# Altium schematic sheet 4_MCU.SchDoc
size A; SheetNumber: 4; SheetTotal: 5
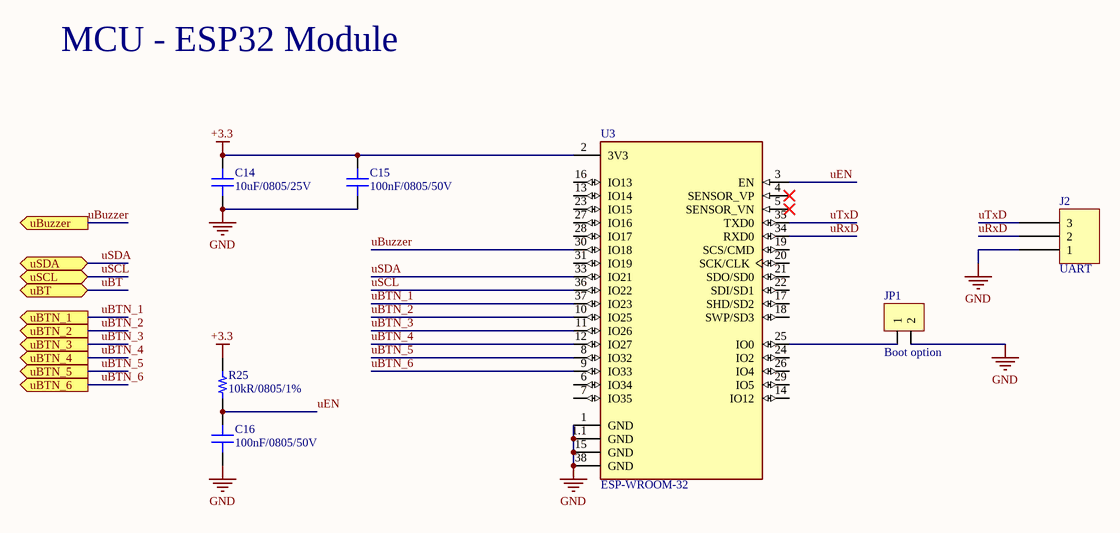
[diagram p0: 4_MCU.SchDoc]

## Parts
C14  10uF/0805/25V  [CAP FILM 0805]
C15  100nF/0805/50V  [CAP FILM 0805]
C16  100nF/0805/50V  [CAP FILM 0805]
J2  UART  [JST B3B-PH-K]
JP1  Boot option  [JP2-CLOSED]
R25  10kR/0805/1%  [RES 0805_2012]
U3  ESP-WROOM-32  [MODULE_ESP-WROOM-32]

## Ports
uBT (bidir), uBTN_1 (out), uBTN_2 (out), uBTN_3 (out), uBTN_4 (out), uBTN_5 (out), uBTN_6 (out), uBuzzer (out), uSCL (bidir), uSDA (bidir)

## Nets
+3.3: C14.2 C15.2 R25.2 U3.2(3V3)
GND: C14.1 C15.1 C16.1 J2.1 JP1.2 U3.1(GND) U3.1.1(GND) U3.15(GND) U3.38(GND)
uBT: port uBT
uBTN_1: U3.37(IO23) ; port uBTN_1
uBTN_2: U3.10(IO25) ; port uBTN_2
uBTN_3: U3.11(IO26) ; port uBTN_3
uBTN_4: U3.12(IO27) ; port uBTN_4
uBTN_5: U3.8(IO32) ; port uBTN_5
uBTN_6: U3.9(IO33) ; port uBTN_6
uBuzzer: U3.30(IO18) ; port uBuzzer
uEN: C16.2 R25.1 U3.3(EN)
uRxD: J2.2 U3.34(RXD0)
uSCL: U3.36(IO22) ; port uSCL
uSDA: U3.33(IO21) ; port uSDA
uTxD: J2.3 U3.35(TXD0)
NetJP1_1: JP1.1 U3.25(IO0)

Not connected (* = marked no-connect by the designer): U3 4(SENSOR_VP)* 5(SENSOR_VN)* 6(IO34) 7(IO35) 13(IO14) 14(IO12) 16(IO13) 17(SHD/SD2) 18(SWP/SD3) 19(SCS/CMD) 20(SCK/CLK) 21(SDO/SD0) 22(SDI/SD1) 23(IO15) 24(IO2) 26(IO4) 27(IO16) 28(IO17) 29(IO5) 31(IO19)

## Notes on the sheet
- MCU - ESP32 Module

## Library data of the parts
C14 = Capacitor - MLCC: Multilayer Ceramic Capacitor, 10 uF, 25 V, ï¿½ 10%, X5R, 0805 [2012 Metric]; Manufacturer: Samsung; Manufacturer Part Number: CL21A106KAYNNNE; Capacitance: 10uF; Voltage Rating: 25V; Supplier 1: Avnet; Supplier Part Number 1: CL21A106KAYNNNE; RoHS: Yes; Category: Ceramic Capacitors; Stock 1: 1478000; Pricing 1: 2000=0.00778 (USD); Mount: Surface Mount; Case/Package: 0805; Case Code (Metric): 2012; Case Code (Imperial): 0805; Material: Ceramic; Min Operating Temperature: -55°C; Max Operating Temperature: 85°C; Package Quantity: 1; Packaging: Tape and Reel; Tolerance: 10%; Dielectric: X5R; Series: CL; Construction: Flat; Voltage Rating (DC): 25V; Length: 2mm; Width: 0.049inch; Height: 1.25mm; Thickness: 0.057inch; Depth: 1.25mm; Radiation Hardening: No; RoHS Compliant: Yes; ComponentLink1URL: https://datasheet.ciiva.com/25796/cl21a106kaynnne-25796720.pdf?src-supplier=Digikey; ComponentLink1Description: https://datasheet.ciiva.com/25796/cl21a106kaynnne-25796720.pdf?src-supplier=Digikey; ComponentLink2URL: https://datasheet.ciiva.com/26838/getdatasheetpartid-357558-26838583.pdf?src-supplier=Verical; ComponentLink2Description: https://datasheet.ciiva.com/26838/getdatasheetpartid-357558-26838583.pdf?src-supplier=Verical
C15 C16 = Capacitor - MLCC: Multilayer Ceramic Capacitor, 0.1 uF, 50 V, ï¿½ 10%, X7R, 0805 [2012 Metric]; Manufacturer: Samsung; Manufacturer Part Number: CL21B104KBCNNNC; Capacitance: 100nF; Voltage Rating: 50V; Supplier 1: Avnet; Supplier Part Number 1: CL21B104KBCNNNC; RoHS: Yes; Category: Ceramic Capacitors; Stock 1: 850000; Pricing 1: 4000=0.0097, 8000=0.00455, 16000=0.00444, 24000=0.00434, 32000=0.00423 (USD); Mount: Surface Mount; Case/Package: 0805; Case Code (Metric): 2012; Case Code (Imperial): 0805; Material: Ceramic; Min Operating Temperature: -55°C; Max Operating Temperature: 125°C; Tolerance: 10%; Dielectric: X7R; Packaging: Tape and Reel; Voltage: 50V; Series: CL; Construction: Flat; Voltage Rating (DC): 50V; Length: 2mm; Width: 0.049inch; Height: 0.85mm; Depth: 1.25mm; Thickness: 0.037inch; Radiation Hardening: No; RoHS Compliant: Yes; Lead Free: 5697LeadFree; ComponentLink1URL: https://datasheet.ciiva.com/25710/cl21b104kbcnnnc-25710182.pdf?src-supplier=Digikey; ComponentLink1Description: https://datasheet.ciiva.com/25710/cl21b104kbcnnnc-25710182.pdf?src-supplier=Digikey; ComponentLink2URL: https://datasheet.ciiva.com/29199/454152-da-01-en-vs-kondensator-0805-29199814.pdf?src-supplier=Conrad; ComponentLink2Description: https://datasheet.ciiva.com/29199/454152-da-01-en-vs-kondensator-0805-29199814.pdf?src-supplier=Conrad
J2 = Connector 3 Pin
JP1 = JP2: WR-PHD 2.54 mm Angled Socket Header; Manufacturer: W¨¹rth Elektronik eiSos GmbH; partNo: 613002143121; ComponentLink1 Description: Manufacturer; ComponentLink2 Description: Datasheet; NoPins: 02; Created Date: 29 March 2013; ComponentLink1URL: http://www.we-online.com; ComponentLink2URL: http://katalog.we-online.de/em/datasheet/6130xx143121.pdf; Created by: Karrer Zheng
R25 = Resistor: SMD Chip Resistor, 10 kOhm, ï¿½ 1%, 125 mW, 0805 [2012 Metric], Thick Film, General Purpose; Manufacturer: Yageo; Manufacturer Part Number: RC0805FR-0710KL; Resistance: 10kR; Temperature Coefficient: 100ppm/°C; Power Rating: 125mW; Voltage Rating: 150V; Supplier 1: Future Electronics; Supplier Part Number 1: 3310877; RoHS: Yes; Category: Chip SMD Resistors; Stock 1: 3290000; Pricing 1: 5000=0.0035, 25000=0.0034, 100000=0.0032, 250000=0.0032, 625000=0.003 (USD); Case/Package: 0805; Case Code (Imperial): 0805; Case Code (Metric): 2012; Size Code: 0805; Min Operating Temperature: -55°C; Max Operating Temperature: 155°C; Tolerance: 1%; Packaging: Tape and Reel; Resistor Type: Thick Film; Package Quantity: 1; Termination: SMD/SMT; Number of Terminations: 2; Max Power Dissipation: 125mW; Features: Moisture Resistant; Series: RC; Construction: Rectangular; Resistance Tolerance: 1%; Technology: THICK FILM; Length: 0.079inch; Width: 0.049inch; Height: 0.024inch; Depth: 1.25mm; Reach SVHC Compliant: Unknown; Lead Free: Lead Free; Military Standard: Not; RoHS Compliant: Yes
U3 = ESP-WROOM-32: Transceptor serie ESP-WROOM-32; Placa de evaluaciÃ³n 802.11 b/g/n (Wi-Fi, WiFi, WLAN), BluetoothÂ® Smart 4.x de bajo consumo (BLE); MF: Espressif Systems; SnapEDA_Link: https://www.snapeda.com/parts/ESP-WROOM-32/Espressif+Systems/view-part/?ref=snap; Package: Module Espressif Systems; Value: *; MP: ESP-WROOM-32; Check_prices: https://www.snapeda.com/parts/ESP-WROOM-32/Espressif+Systems/view-part/?ref=eda